# Altium schematic sheet Dustbike_Core_Top.SchDoc: Edit Title in Document Parameters
size B; Address1: # and Street; Address2: City, State, Zip; Address3: Phone#; Address4: USA; DocumentNumber: 1; SheetNumber: 1; SheetTotal: 4; CompanyName: CompanyName; TemplateRev: D-PCD-0111-01
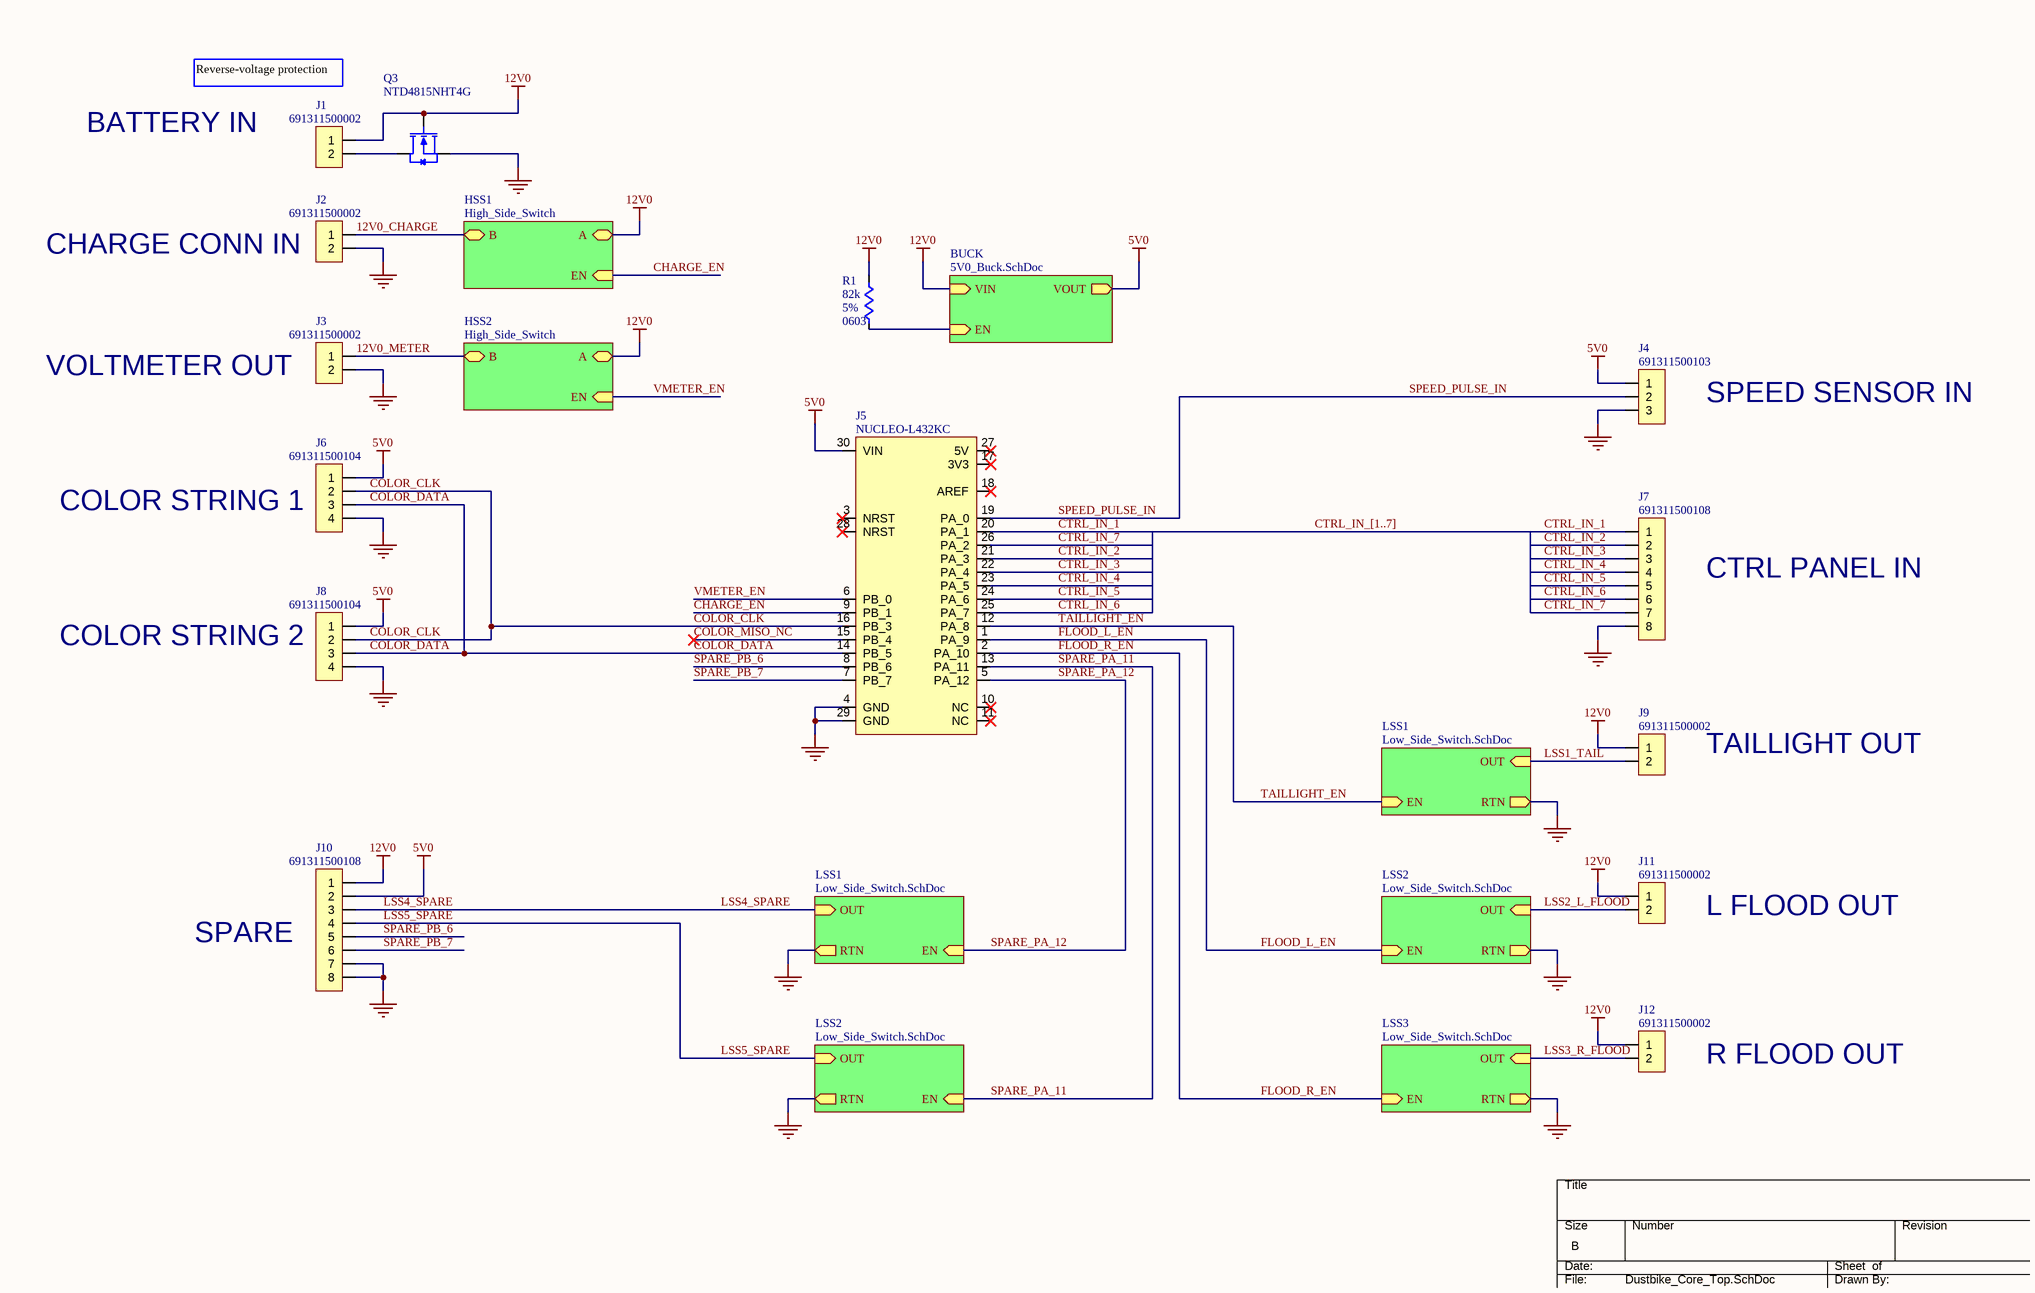
[diagram p0: Dustbike_Core_Top.SchDoc]

## Parts
J1  Manufacturer Part Number 1: 691311500002  [WURTH_691311500002]  (hidden comment: HDR_2POS)
J2  Manufacturer Part Number 1: 691311500002  [WURTH_691311500002]  (hidden comment: HDR_2POS)
J3  Manufacturer Part Number 1: 691311500002  [WURTH_691311500002]  (hidden comment: HDR_2POS)
J4  Manufacturer Part Number 1: 691311500103  [WURTH_691311500103]  (hidden comment: HDR_3POS)
J5  Manufacturer Part Number 1: NUCLEO-L432KC  [NANO_HEADER]  (hidden comment: NUCLEO_NANO)
J6  Manufacturer Part Number 1: 691311500104  [WURTH_691311500104]  (hidden comment: HDR_4POS)
J7  Manufacturer Part Number 1: 691311500108  [WURTH_691311500108]  (hidden comment: HDR_8POS)
J8  Manufacturer Part Number 1: 691311500104  [WURTH_691311500104]  (hidden comment: HDR_4POS)
J9  Manufacturer Part Number 1: 691311500002  [WURTH_691311500002]  (hidden comment: HDR_2POS)
J10  Manufacturer Part Number 1: 691311500108  [WURTH_691311500108]  (hidden comment: HDR_8POS)  (no BOM)
J11  Manufacturer Part Number 1: 691311500002  [WURTH_691311500002]  (hidden comment: HDR_2POS)
J12  Manufacturer Part Number 1: 691311500002  [WURTH_691311500002]  (hidden comment: HDR_2POS)
Q3  Manufacturer Part Number 1: NTD4815NHT4G  [DPAK228P991X238-3N_NTD4815NHT4G]  (hidden comment: NFET_SOT323)
R1  value 82k  Tolerance: 5%  Package: 0603  [RESC1508X09N]  (hidden comment: RES)

## Sub-sheets
BUCK = 5V0_Buck.SchDoc: VIN (in), VOUT (out), EN (in)
HSS1 = High_Side_Switch: A (bidir), B (bidir), EN (in)
HSS2 = High_Side_Switch: A (bidir), B (bidir), EN (in)
LSS1 = Low_Side_Switch.SchDoc: OUT (in), RTN (out), EN (in)
LSS1 = Low_Side_Switch.SchDoc: OUT (in), RTN (out), EN (in)
LSS2 = Low_Side_Switch.SchDoc: OUT (in), RTN (out), EN (in)
LSS2 = Low_Side_Switch.SchDoc: OUT (in), RTN (out), EN (in)
LSS3 = Low_Side_Switch.SchDoc: OUT (in), RTN (out), EN (in)

## Nets
5V0: J4.1 J5.30(VIN) J6.1 J8.1 J10.2 ; sheet BUCK/VOUT
12V0: J1.1 J9.1 J10.1 J11.1 J12.1 Q3.G R1.2 ; sheet BUCK/VIN, sheet HSS1/A, sheet HSS2/A
GND: J2.2 J3.2 J4.3 J5.4(GND) J5.29(GND) J6.4 J7.8 J8.4 J10.7 J10.8 Q3.S ; sheet LSS1/RTN, sheet LSS2/RTN, sheet LSS3/RTN, sheet LSS1/RTN, sheet LSS2/RTN
12V0_CHARGE: J2.1 ; sheet HSS1/B
12V0_METER: J3.1 ; sheet HSS2/B
CHARGE_EN: J5.9(PB_1) ; sheet HSS1/EN
COLOR_CLK: J5.16(PB_3) J6.2 J8.2
COLOR_DATA: J5.14(PB_5) J6.3 J8.3
COLOR_MISO_NC: J5.15(PB_4)
CTRL_IN_1: J5.20(PA_1) J7.1
CTRL_IN_2: J5.21(PA_3) J7.2
CTRL_IN_3: J5.22(PA_4) J7.3
CTRL_IN_4: J5.23(PA_5) J7.4
CTRL_IN_5: J5.24(PA_6) J7.5
CTRL_IN_6: J5.25(PA_7) J7.6
CTRL_IN_7: J5.26(PA_2) J7.7
FLOOD_L_EN: J5.1(PA_9) ; sheet LSS2/EN
FLOOD_R_EN: J5.2(PA_10) ; sheet LSS3/EN
LSS1_TAIL: J9.2 ; sheet LSS1/OUT
LSS2_L_FLOOD: J11.2 ; sheet LSS2/OUT
LSS3_R_FLOOD: J12.2 ; sheet LSS3/OUT
LSS4_SPARE: J10.3 ; sheet LSS1/OUT
LSS5_SPARE: J10.4 ; sheet LSS2/OUT
SPARE_PA_11: J5.13(PA_11) ; sheet LSS2/EN
SPARE_PA_12: J5.5(PA_12) ; sheet LSS1/EN
SPARE_PB_6: J5.8(PB_6) J10.5
SPARE_PB_7: J5.7(PB_7) J10.6
SPEED_PULSE_IN: J4.2 J5.19(PA_0)
TAILLIGHT_EN: J5.12(PA_8) ; sheet LSS1/EN
VMETER_EN: J5.6(PB_0) ; sheet HSS2/EN
NetJ1_2: J1.2 Q3.D
NetR1_1: R1.1 ; sheet BUCK/EN

Not connected (* = marked no-connect by the designer): J5 3(NRST)* 10(NC)* 11(NC)* 17(3V3)* 18(AREF)* 27(5V)* 28(NRST)*

## Buses and harness runs
bus CTRL_IN_[1..7]

## Notes on the sheet
- Reverse-voltage protection
- BATTERY IN
- CHARGE CONN IN
- VOLTMETER OUT
- SPEED SENSOR IN
- COLOR STRING 1
- CTRL PANEL IN
- COLOR STRING 2
- TAILLIGHT OUT
- SPARE
- L FLOOD OUT
- R FLOOD OUT
- 4
- 3
- 2
- 1
- D
- C
- B
- 1455 Market St., Ste 600
- A
- San Francisco, CA 94103
- WWW.SQUAREUP.COM
- SIZE
- TITLE
- PRINT DATE
- DRAWING NO.
- REVISION
- RELEASE/EDITION
- © SQUARE INC
- PROPRIETARY AND CONFIDENTIAL.
- ALL RIGHTS RESERVED. NO DUPLICATION, USE OR
- DISCLOSURES WITHOUT PRIOR WRITTEN APPROVAL.
- JIRA EPIC
- SHEET            OF

## Library data of the parts
J1-J3 J9 J11 J12 = GEN-CN-0001: TERM BLOCK HDR 2POS VERT 5.08MM; Manufacturer 1: Würth Elektronik; Connector Type: Header, Male Pins, Shrouded (2 Side); Gender: Male Pins; Number of Positions/Contacts: 2; Voltage - Rated: 300V; Current Rating: 20A; Body Color: Green; Manufacturer Part Number: *; TPN: GEN-CN-0001; Series: WR-TBL Series 3211; Mounting Type: Through Hole; Contact Material - Plating: Brass; Housing Material: Polybutylene Terephthalate (PBT); Contact Material: Brass; Operating Temperature: -40°C ~ 105°C; Supplier 1: Digi-Key; Supplier Part Number 1: 732-2052-ND; Supplier Link 1: https://www.digikey.com/en/products/detail/w%C3%BCrth-elektronik/691311500002/2060548
J4 = GEN-CN-0002: TERM BLOCK HDR 3POS VERT 5.08MM; Manufacturer 1: Würth Elektronik; Connector Type: Header, Male Pins, Shrouded (4 Side); Gender: Male Pins; Number of Positions/Contacts: 3; Voltage - Rated: 300V; Current Rating: 20A; Body Color: Green; Manufacturer Part Number: *; TPN: GEN-CN-0002; Series: WR-TBL Series 311; Mounting Type: Through Hole; Contact Material - Plating: Brass; Housing Material: Polybutylene Terephthalate (PBT); Contact Material: Brass; Operating Temperature: -40°C ~ 105°C; Supplier 1: Digi-Key; Supplier Part Number 1: 732-2059-ND; Supplier Link 1: https://www.digikey.com/en/products/detail/w%C3%BCrth-elektronik/691311500002/2060548
J5 = MOD-0001: NUCLEO-32 STM32L432KC EVAL BRD; Manufacturer 1: STMicroelectronics; TPN: MOD-0001; Supplier 1: Digi-Key; Supplier Part Number 1: 497-16592-ND; Supplier Link 1: https://www.digikey.com/en/products/detail/NUCLEO-L432KC/497-16592-ND/6132763?itemSeq=297939740
J6 J8 = GEN-CN-0003: TERM BLOCK HDR 4POS VERT 5.08MM; Manufacturer 1: Würth Elektronik; Connector Type: Header, Male Pins, Shrouded (4 Side); Gender: Male Pins; Number of Positions/Contacts: 4; Voltage - Rated: 300V; Current Rating: 20A; Body Color: Green; Manufacturer Part Number: *; TPN: GEN-CN-0003; Series: WR-TBL Series 311; Mounting Type: Through Hole; Contact Material - Plating: Brass; Housing Material: Polybutylene Terephthalate (PBT); Contact Material: Brass; Operating Temperature: -40°C ~ 105°C; Supplier 1: Digi-Key; Supplier Part Number 1: 732-2060-ND; Supplier Link 1: https://www.digikey.com/en/products/detail/w%C3%BCrth-elektronik/691311500104/2060556
J7 J10 = GEN-CN-0004: TERM BLOCK HDR 8POS VERT 5.08MM; Manufacturer 1: Würth Elektronik; Connector Type: Header, Male Pins, Shrouded (4 Side); Gender: Male Pins; Number of Positions/Contacts: 8; Voltage - Rated: 300V; Current Rating: 20A; Body Color: Green; Manufacturer Part Number: *; TPN: GEN-CN-0004; Series: WR-TBL Series 311; Mounting Type: Through Hole; Contact Material - Plating: Brass; Housing Material: Polybutylene Terephthalate (PBT); Contact Material: Brass; Operating Temperature: -40°C ~ 105°C; Supplier 1: Digi-Key; Supplier Part Number 1: 732-2063-ND; Supplier Link 1: https://www.digikey.com/en/products/detail/w%C3%BCrth-elektronik/691311500108/2060559
Q3 = NMOS-0002: MOSFET N-CH 30V 6.9A/35A DPAK; Manufacturer 1: onsemi; Type: NFET; Current - Max Continuous: 6.9A; Gate Charge (Qg) (Max) @ Vgs: 6.8 nC @ 4.5 V; Vgs (Max): 20V; Rds On (Max) @ Id, Vgs: 15mOhm @ 30A, 10V; Vgs(th) (Max) @ Id: 2.5V @ 250µA; Drive Voltage (Max Rds On, Min Rds On): 4.5V, 11.5V; TPN: NMOS-0002; Supplier 1: Digi-Key; Supplier Part Number 1: NTD4815NHT4GOSCT-ND; Drain to Source Voltage (Vdss): 30V; Gate Charge (Qg) @ Vgs: 6.8 nC @ 4.5 V; Operating Temperature: -55°C ~ 175°C (TJ); Package / Case: TO-252-3, DPak (2 Leads + Tab), SC-63; ComponentLink1URL: https://www.onsemi.com/pdf/datasheet/ntd4815nh-d.pdf; ComponentLink1Description: Datasheet; ComponentLink2URL: https://www.digikey.com/en/products/detail/onsemi/NTD4815NHT4G/1792971; ComponentLink2Description: Supplier Link
R1 = RES-SM-0288: RES 82K OHM 5% 0603; Power Rating: 0.125; Pulse-Rated: No; TPN: RES-SM-0288